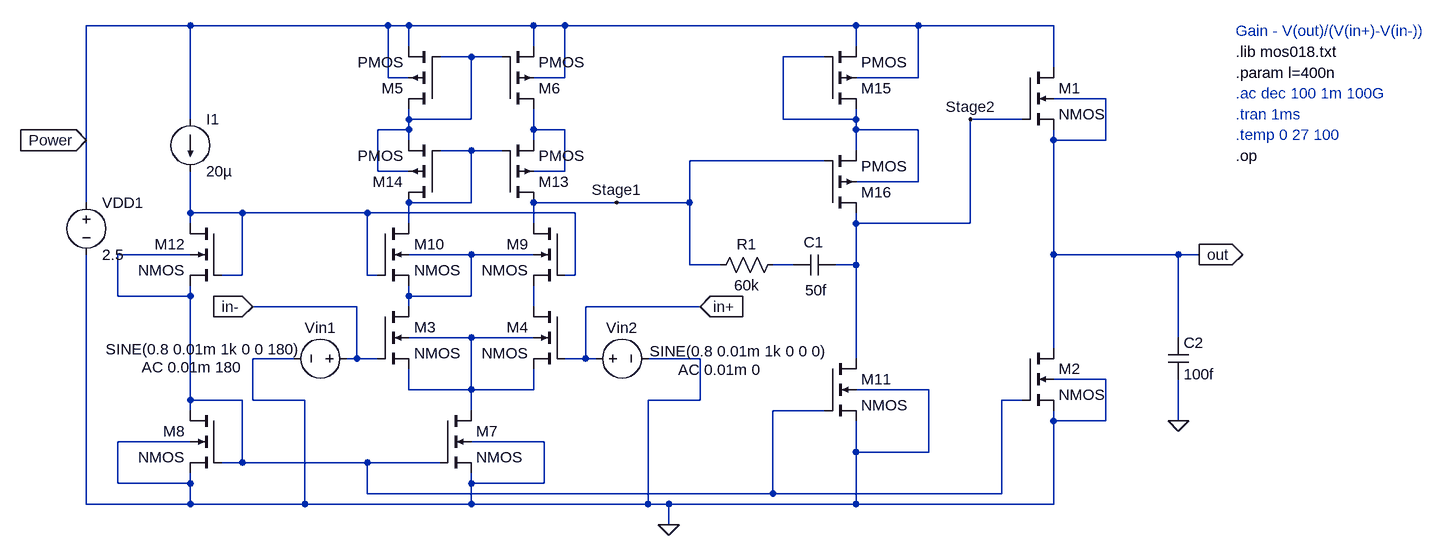
[diagram p0: schematic OP.asc]
OP.asc, the LTspice schematic file:
Version 4
SHEET 1 1412 680
WIRE -496 -208 -656 -208
WIRE -192 -208 -496 -208
WIRE -160 -208 -192 -208
WIRE 32 -208 -160 -208
WIRE 80 -208 32 -208
WIRE 528 -208 80 -208
WIRE 624 -208 528 -208
WIRE 832 -208 624 -208
WIRE -160 -176 -160 -208
WIRE 32 -176 32 -208
WIRE 528 -176 528 -208
WIRE -64 -160 -112 -160
WIRE -16 -160 -64 -160
WIRE 480 -160 416 -160
WIRE 832 -144 832 -208
WIRE -192 -128 -192 -208
WIRE -160 -128 -192 -128
WIRE 80 -128 80 -208
WIRE 80 -128 32 -128
WIRE 624 -128 624 -208
WIRE 624 -128 528 -128
WIRE 912 -96 832 -96
WIRE -496 -64 -496 -208
WIRE -160 -64 -160 -80
WIRE -64 -64 -64 -160
WIRE -64 -64 -160 -64
WIRE 416 -64 416 -160
WIRE 528 -64 528 -80
WIRE 528 -64 416 -64
WIRE 784 -64 704 -64
WIRE -160 -48 -160 -64
WIRE -160 -48 -208 -48
WIRE 32 -48 32 -80
WIRE 80 -48 32 -48
WIRE 528 -48 528 -64
WIRE 624 -48 528 -48
WIRE -656 -32 -656 -208
WIRE -160 -32 -160 -48
WIRE 32 -32 32 -48
WIRE 832 -32 832 -48
WIRE 912 -32 912 -96
WIRE 912 -32 832 -32
WIRE -64 -16 -112 -16
WIRE -16 -16 -64 -16
WIRE 528 -16 528 -48
WIRE 480 0 272 0
WIRE -208 16 -208 -48
WIRE -160 16 -208 16
WIRE 80 16 80 -48
WIRE 80 16 32 16
WIRE 624 32 624 -48
WIRE 624 32 528 32
WIRE -656 64 -656 -32
WIRE -64 64 -64 -16
WIRE -64 64 -160 64
WIRE 160 64 32 64
WIRE 272 64 272 0
WIRE 272 64 160 64
WIRE -496 80 -496 16
WIRE -416 80 -496 80
WIRE -224 80 -416 80
WIRE 96 80 -224 80
WIRE -496 96 -496 80
WIRE -160 96 -160 64
WIRE 32 96 32 64
WIRE 528 96 528 80
WIRE 704 96 704 -64
WIRE 704 96 528 96
WIRE -496 144 -608 144
WIRE -64 144 -160 144
WIRE 32 144 -64 144
WIRE 832 144 832 -32
WIRE 1024 144 832 144
WIRE 1056 144 1024 144
WIRE 272 160 272 64
WIRE 320 160 272 160
WIRE 432 160 400 160
WIRE 528 160 528 96
WIRE 528 160 496 160
WIRE -416 176 -416 80
WIRE -416 176 -448 176
WIRE -224 176 -224 80
WIRE -208 176 -224 176
WIRE 96 176 96 80
WIRE 96 176 80 176
WIRE -608 208 -608 144
WIRE -496 208 -496 192
WIRE -496 208 -608 208
WIRE -160 208 -160 192
WIRE -64 208 -64 144
WIRE -64 208 -160 208
WIRE -240 224 -400 224
WIRE -160 224 -160 208
WIRE 32 224 32 192
WIRE 288 224 112 224
WIRE -64 272 -160 272
WIRE 32 272 -64 272
WIRE 1024 272 1024 144
WIRE 832 288 832 144
WIRE -336 304 -400 304
WIRE -240 304 -240 224
WIRE -240 304 -256 304
WIRE -208 304 -240 304
WIRE 112 304 112 224
WIRE 112 304 80 304
WIRE 128 304 112 304
WIRE 288 304 208 304
WIRE 528 304 528 160
WIRE 912 336 832 336
WIRE -160 352 -160 320
WIRE -64 352 -64 272
WIRE -64 352 -160 352
WIRE 32 352 32 320
WIRE 32 352 -64 352
WIRE 640 352 528 352
WIRE -496 368 -496 208
WIRE -416 368 -496 368
WIRE -400 368 -400 304
WIRE -320 368 -400 368
WIRE 288 368 288 304
WIRE 288 368 208 368
WIRE 784 368 752 368
WIRE -496 384 -496 368
WIRE -64 384 -64 352
WIRE 480 384 400 384
WIRE 832 400 832 384
WIRE 912 400 912 336
WIRE 912 400 832 400
WIRE 1024 400 1024 336
WIRE -496 432 -608 432
WIRE 48 432 -64 432
WIRE 528 448 528 400
WIRE 640 448 640 352
WIRE 640 448 528 448
WIRE -416 464 -416 368
WIRE -416 464 -448 464
WIRE -224 464 -416 464
WIRE -112 464 -224 464
WIRE -608 496 -608 432
WIRE -496 496 -496 480
WIRE -496 496 -608 496
WIRE -64 496 -64 480
WIRE 48 496 48 432
WIRE 48 496 -64 496
WIRE -224 512 -224 464
WIRE 400 512 400 384
WIRE 400 512 -224 512
WIRE 752 512 752 368
WIRE 752 512 400 512
WIRE -656 528 -656 144
WIRE -496 528 -496 496
WIRE -496 528 -656 528
WIRE -320 528 -320 368
WIRE -320 528 -496 528
WIRE -64 528 -64 496
WIRE -64 528 -320 528
WIRE 208 528 208 368
WIRE 208 528 -64 528
WIRE 240 528 208 528
WIRE 528 528 528 448
WIRE 528 528 240 528
WIRE 832 528 832 400
WIRE 832 528 528 528
WIRE 240 560 240 528
FLAG 1056 144 out
IOPIN 1056 144 Out
FLAG 240 560 0
FLAG 288 224 in+
IOPIN 288 224 In
FLAG -400 224 in-
IOPIN -400 224 In
FLAG 160 64 Stage1
FLAG 704 -64 Stage2
FLAG -656 -32 Power
IOPIN -656 -32 In
FLAG 1024 400 0
SYMBOL nmos4 784 -144 R0
SYMATTR InstName M1
SYMATTR Value2 l={l} w=0.5u m=20
SYMBOL nmos4 784 288 R0
SYMATTR InstName M2
SYMATTR Value2 l={l} w=10u m=3
SYMBOL nmos4 -208 224 R0
SYMATTR InstName M3
SYMATTR Value2 l={l} w=0.5u m=1
SYMBOL nmos4 80 224 M0
SYMATTR InstName M4
SYMATTR Value2 l={l} w=0.5u m=1
SYMBOL pmos4 -112 -80 R180
SYMATTR InstName M5
SYMATTR Value2 l={l} w=1u m=2
SYMBOL pmos4 -16 -80 M180
SYMATTR InstName M6
SYMATTR Value2 l={l} w=1u m=2
SYMBOL nmos4 -112 384 R0
SYMATTR InstName M7
SYMATTR Value2 l={l} w=2u
SYMBOL current -496 -64 R0
WINDOW 123 0 0 Left 0
WINDOW 39 0 0 Left 0
SYMATTR InstName I1
SYMATTR Value 20µ
SYMBOL nmos4 -448 384 M0
SYMATTR InstName M8
SYMATTR Value2 l={l} w=10u
SYMBOL voltage -656 48 R0
WINDOW 123 0 0 Left 0
WINDOW 39 0 0 Left 0
SYMATTR InstName VDD1
SYMATTR Value 2.5
SYMBOL voltage -240 304 R90
WINDOW 0 -32 56 VBottom 2
WINDOW 3 -30 236 VTop 2
WINDOW 123 -2 254 VTop 2
WINDOW 39 -2 236 VTop 2
SYMATTR InstName Vin1
SYMATTR Value SINE(0.8 0.01m 1k 0 0 180)
SYMATTR Value2 AC 0.01m 180
SYMBOL voltage 112 304 R270
WINDOW 0 32 56 VTop 2
WINDOW 3 27 235 VBottom 2
WINDOW 123 -2 206 VBottom 2
WINDOW 39 -1 235 VBottom 2
SYMATTR InstName Vin2
SYMATTR Value SINE(0.8 0.01m 1k 0 0 0)
SYMATTR Value2 AC 0.01m 0
SYMBOL nmos4 80 96 M0
SYMATTR InstName M9
SYMATTR Value2 l={l} w=0.5u m=1
SYMBOL nmos4 -208 96 R0
SYMATTR InstName M10
SYMATTR Value2 l={l} w=0.5u m=1
SYMBOL nmos4 480 304 R0
SYMATTR InstName M11
SYMATTR Value2 l={l} w=1u m=5
SYMBOL cap 496 144 R90
WINDOW 0 -3 33 VBottom 2
WINDOW 3 39 29 VTop 2
SYMATTR InstName C1
SYMATTR Value 50f
SYMBOL nmos4 -448 96 M0
SYMATTR InstName M12
SYMATTR Value2 l={l} w=1u
SYMBOL pmos4 -16 64 M180
SYMATTR InstName M13
SYMATTR Value2 l={l} w=1u m=1
SYMBOL pmos4 -112 64 R180
SYMATTR InstName M14
SYMATTR Value2 l={l} w=1u m=1
SYMBOL pmos4 480 -80 M180
SYMATTR InstName M15
SYMATTR Value2 l={l} w=0.5u m=25
SYMBOL pmos4 480 80 M180
SYMATTR InstName M16
SYMATTR Value2 l={l} w=0.5u m=10
SYMBOL res 416 144 R90
WINDOW 0 0 56 VBottom 2
WINDOW 3 32 56 VTop 2
SYMATTR InstName R1
SYMATTR Value 60k
SYMBOL cap 1008 272 R0
SYMATTR InstName C2
SYMATTR Value 100f
TEXT 1112 -72 Left 2 ;.tran 1ms
TEXT 1112 -40 Left 2 ;.temp 0 27 100
TEXT 1112 -104 Left 2 ;.ac dec 100 1m 100G
TEXT 1112 -136 Left 2 !.param l=400n
TEXT 1112 -168 Left 2 !.lib mos018.txt
TEXT 1112 -200 Left 2 ;Gain - V(out)/(V(in+)-V(in-))
TEXT 1112 -8 Left 2 !.op

The netlist it stands for:
* OP.asc
M1 Power Stage2 out out NMOS l={l} w=0.5u m=20
M2 out N006 0 0 NMOS l={l} w=10u m=3
M3 N007 in- N010 N010 NMOS l={l} w=0.5u m=1
M4 N009 in+ N010 N010 NMOS l={l} w=0.5u m=1
M5 N001 N001 Power Power PMOS l={l} w=1u m=2
M6 N003 N001 Power Power PMOS l={l} w=1u m=2
M7 N010 N006 0 0 NMOS l={l} w=2u
I1 Power N005 20µ
M8 N006 N006 0 0 NMOS l={l} w=10u
VDD1 Power 0 2.5
Vin1 in- 0 SINE(0.8 0.01m 1k 0 0 180) AC 0.01m 180
Vin2 in+ 0 SINE(0.8 0.01m 1k 0 0 0) AC 0.01m 0
M9 Stage1 N005 N009 N007 NMOS l={l} w=0.5u m=1
M10 N004 N005 N007 N007 NMOS l={l} w=0.5u m=1
M11 Stage2 N006 0 0 NMOS l={l} w=1u m=5
C1 Stage2 N008 50f
M12 N005 N005 N006 N006 NMOS l={l} w=1u
M13 Stage1 N004 N003 N003 PMOS l={l} w=1u m=1
M14 N004 N004 N001 N001 PMOS l={l} w=1u m=1
M15 N002 N002 Power Power PMOS l={l} w=0.5u m=25
M16 Stage2 Stage1 N002 N002 PMOS l={l} w=0.5u m=10
R1 N008 Stage1 60k
C2 out 0 100f
.model NMOS NMOS
.model PMOS PMOS
.lib standard.mos
* .tran 1ms
* .temp 0 27 100
* .ac dec 100 1m 100G
.param l=400n
.lib mos018.txt
* Gain - V(out)/(V(in+)-V(in-))
.op
.backanno
.end